# Altium schematic sheet Main.SchDoc
size A3
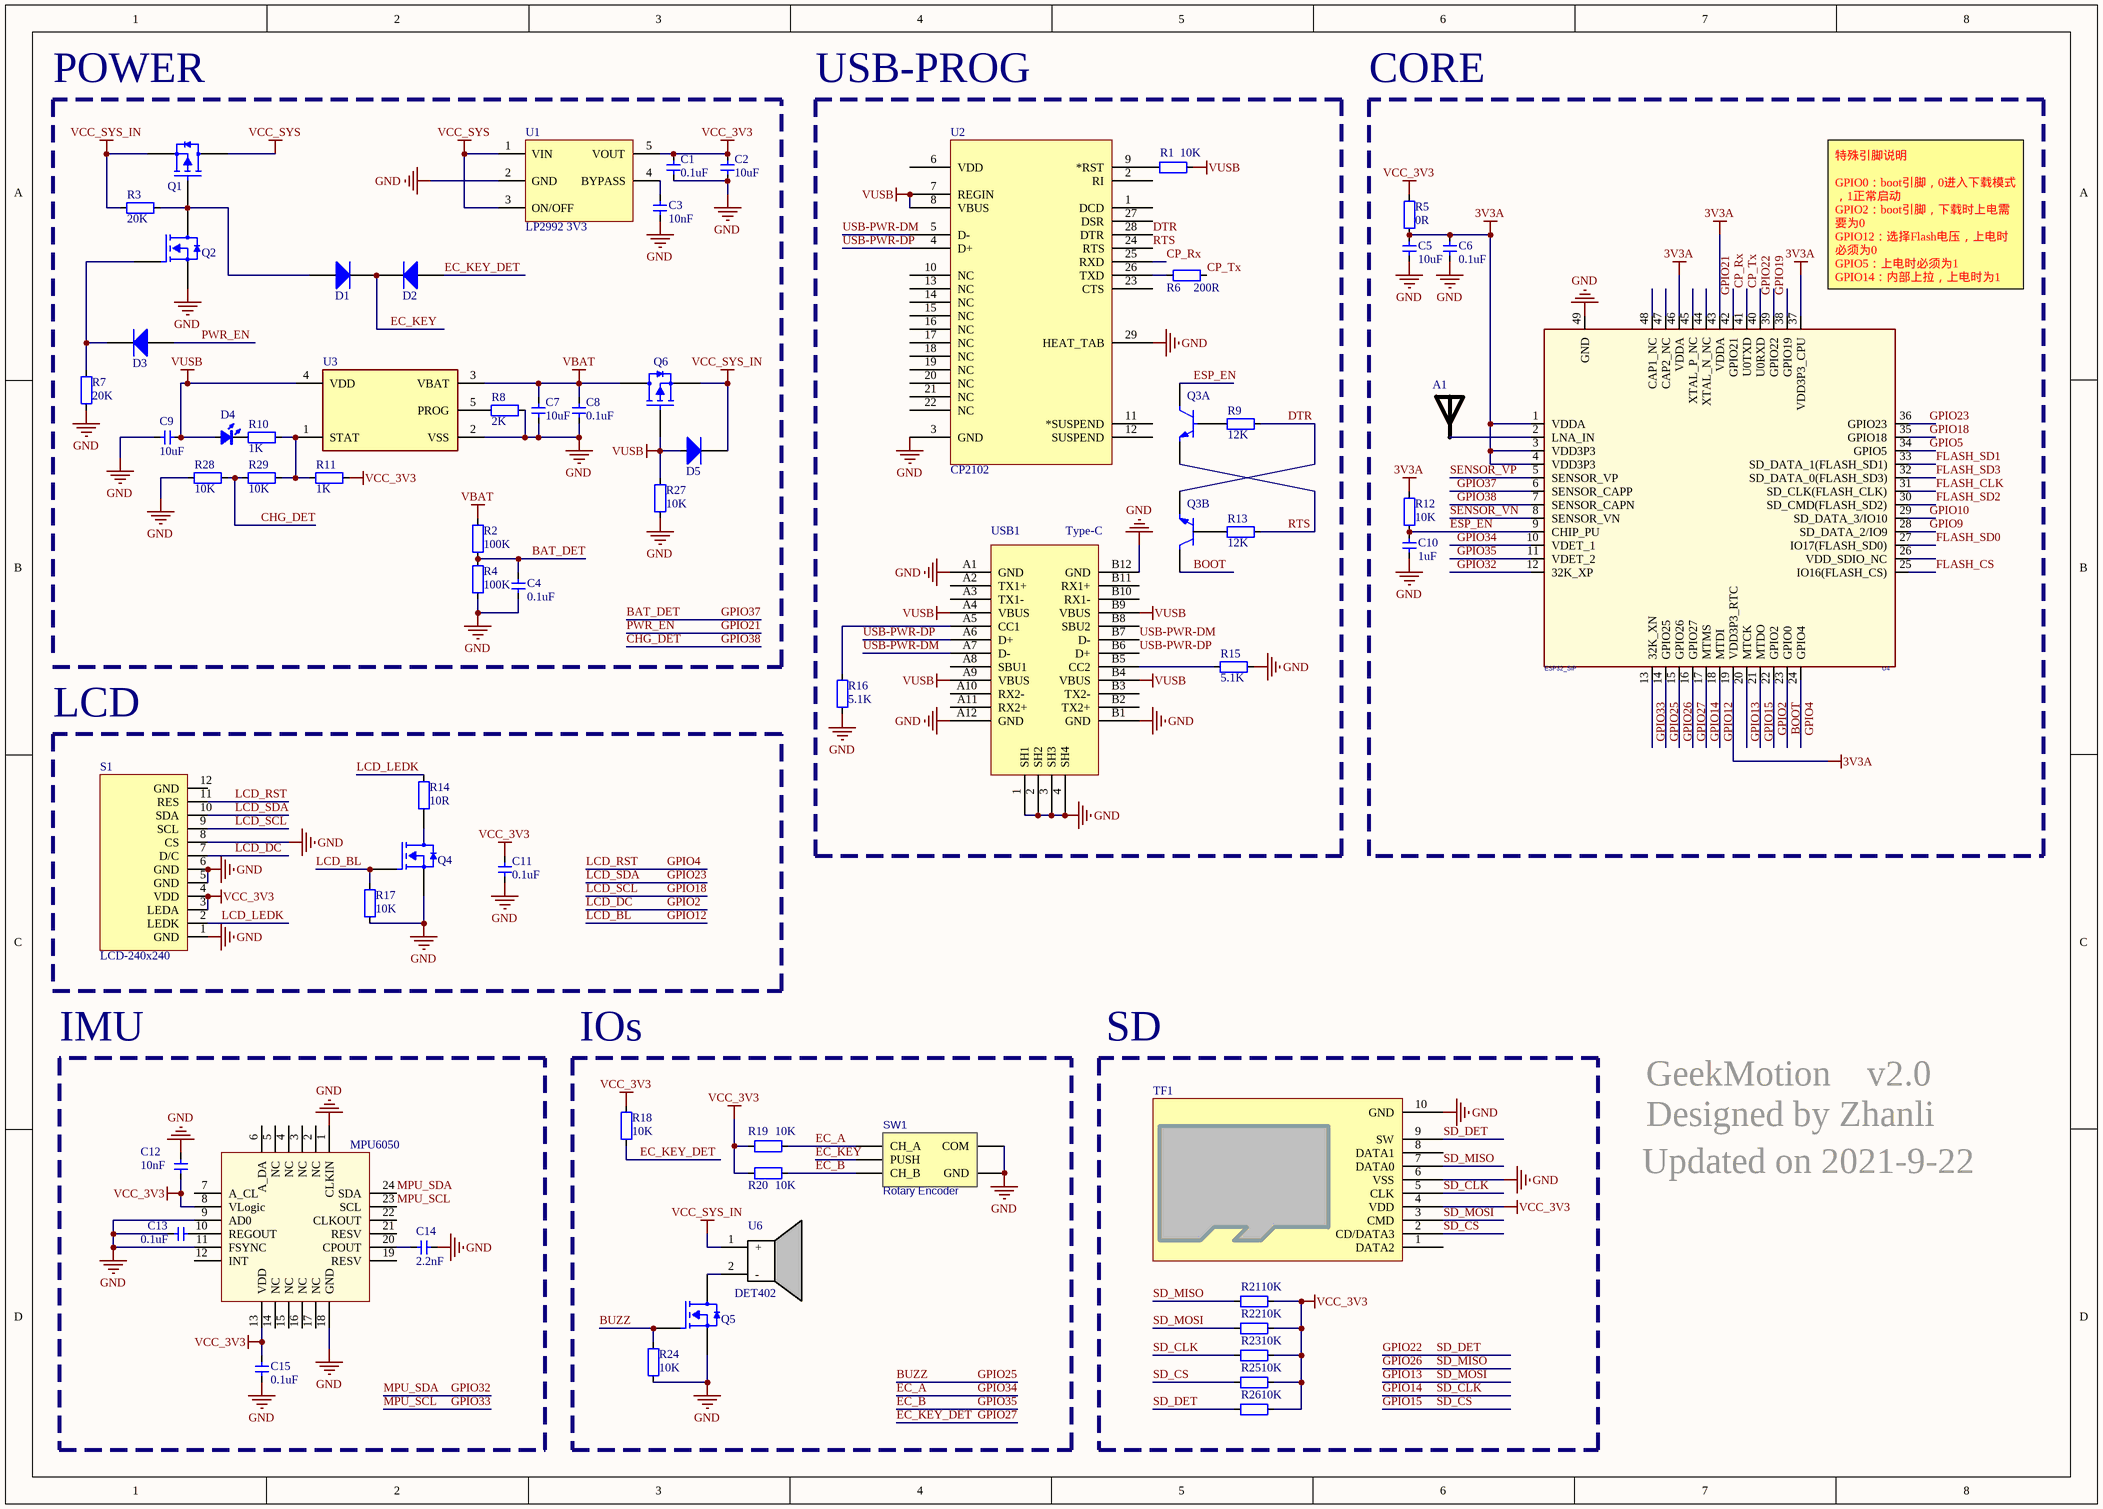
[diagram p0: Main.SchDoc]

## Parts
A1  RAINSUN  [ANT-Rainsun-AN5120]  (value not drawn)
C1  0.1uF  [CAP_0402]
C2  10uF  [CAP_0402]
C3  10nF  [CAP_0402]
C4  0.1uF  [CAP_0402]
C5  10uF  [CAP_0402]
C6  0.1uF  [CAP_0402]
C7  10uF  [CAP_0402]
C8  0.1uF  [CAP_0402]
C9  10uF  [CAP_0402]
C10  1uF  [CAP_0402]
C11  0.1uF  [CAP_0402]
C12  10nF  [CAP_0402]
C13  0.1uF  [CAP_0402]
C14  2.2nF  [CAP_0402]
C15  0.1uF  [CAP_0402]
D1  二极管-5819W  [SOD-323]  (value not drawn)
D2  二极管-5819W  [SOD-323]  (value not drawn)
D3  二极管-5819W  [SOD-323]  (value not drawn)
D4  color?  [LED_0402_RED]  (value not drawn)
D5  二极管-5819W  [SOD-323]  (value not drawn)
Q1  AO3401A  [SOT23-3]  (value not drawn)
Q2  AO3400A  [SOT23-3]  (value not drawn)
Q3  BC847BVC-7  [SOT563-6]  (value not drawn)  (parts A,B of 2)
Q4  AO3400A  [SOT23-3]  (value not drawn)
Q5  AO3400A  [SOT23-3]  (value not drawn)
Q6  AO3401A  [SOT23-3]  (value not drawn)
R1  10K  [RES_0402]
R2  100K  [RES_0402]
R3  20K  [RES_0402]
R4  100K  [RES_0402]
R5  0R  [RES_0402]
R6  200R  [RES_0402]
R7  20K  [RES_0402]
R8  2K  [RES_0402]
R9  12K  [RES_0402]
R10  1K  [RES_0402]
R11  1K  [RES_0402]
R12  10K  [RES_0402]
R13  12K  [RES_0402]
R14  10R  [RES_0402]
R15  5.1K  [RES_0402]
R16  5.1K  [RES_0402]
R17  10K  [RES_0402]
R18  10K  [RES_0402]
R19  10K  [RES_0402]
R20  10K  [RES_0402]
R21  10K  [RES_0402]
R22  10K  [RES_0402]
R23  10K  [RES_0402]
R24  10K  [RES_0402]
R25  10K  [RES_0402]
R26  10K  [RES_0402]
R27  10K  [RES_0402]
R28  10K  [RES_0402]
R29  10K  [RES_0402]
S1  LCD-240x240  [LCD-240x240-FlUSH-154]
SW1  Rotary Encoder  [SIQ-02FVS3]
TF1  TF  [TF-SOCKET]  (value not drawn)
U1  LP2992 3V3  [SOT23-5]
U2  CP2102  [QFN-28]
U3  MCP73831T  [SOT23-5]  (value not drawn)
U4  ESP32_SIP  [QFN-48_7X7]
U5  MPU6050  [QFN-24]
U6  DET402  [DET402]
USB1  Type-C  [Type-C-TOP]

## Blocks framed on the sheet
USB-PROG: Q3 R1 R6 R9 R13 R15 R16 U2 USB1
IMU: C12-C15 U5
IOs: Q5 R18-R20 R24 SW1 U6
SD: R21-R23 R25 R26 TF1

## Nets
3V3A: C5.2 C6.2 R5.2 R12.1 U4.1(VDDA) U4.3(VDD3P3) U4.4(VDD3P3) U4.19(VDD3P3_RTC) U4.37(VDD3P3_CPU) U4.43(VDDA) U4.46(VDDA)
GND: C1.1 C2.1 C3.1 C4.1 C5.1 C6.1 C7.1 C8.1 C9.1 C10.2 C11.1 C12.2 C13.2 C14.1 C15.1 Q2.2(S) Q4.2(S) Q5.2(S) R4.1 R7.1 R8.2 R15.1 R16.2 R17.1 R24.1 R27.1 R28.2 S1.1(GND) S1.5(GND) S1.6(GND) S1.8(CS) SW1.3(COM) SW1.5(GND) TF1.6(VSS) TF1.10(GND) U1.2(GND) U2.3(GND) U2.29(HEAT_TAB) U3.2(VSS) U4.49(GND) U5.1(CLKIN) U5.9(AD0) U5.11(FSYNC) U5.18(GND) USB1.1(SH1) USB1.2(SH2) USB1.3(SH3) USB1.4(SH4) USB1.A1(GND) USB1.A12(GND) USB1.B1(GND) USB1.B12(GND)
VBAT: C7.2 C8.2 Q6.3(D) R2.2 U3.3(VBAT)
VCC_3V3: C1.2 C2.2 C11.2 C12.1 C15.2 R5.1 R11.2 R18.1 R19.2 R20.2 R21.1 R22.1 R23.1 R25.1 R26.1 S1.3(LEDA) S1.4(VDD) TF1.4(VDD) U1.5(VOUT) U5.8(VLogic) U5.13(VDD)
VCC_SYS: Q1.3(D) U1.1(VIN) U1.3(ON/OFF)
VCC_SYS_IN: D5.2(K) Q1.2(S) Q6.2(S) R3.1 U6.1(+)
VUSB: C9.2 D4.1(A) D5.1(A) Q6.1(G) R1.1 R27.2 U2.7(REGIN) U2.8(VBUS) U3.4(VDD) USB1.A4(VBUS) USB1.A9(VBUS) USB1.B4(VBUS) USB1.B9(VBUS)
BAT_DET: C4.2 R2.1 R4.2 U4.6(SENSOR_CAPP)  [also labelled GPIO37]
BOOT: Q3.3(C2) U4.23(GPIO0)
BUZZ: Q5.1(G) R24.2 U4.14(GPIO25)  [also labelled GPIO25]
CHG_DET: R28.1 R29.2 U4.7(SENSOR_CAPN)  [also labelled GPIO38]
CP_Rx: U2.25(RXD) U4.41(U0TXD)
CP_Tx: R6.1 U4.40(U0RXD)
DTR: Q3.4(E2) R9.1 U2.28(DTR)
EC_A: R19.1 SW1.1(CH_A) U4.10(VDET_1)  [also labelled GPIO34]
EC_B: R20.1 SW1.4(CH_B) U4.11(VDET_2)  [also labelled GPIO35]
EC_KEY: D1.2(K) D2.2(K) SW1.2(PUSH)
EC_KEY_DET: D2.1(A) R18.2 U4.16(GPIO27)  [also labelled GPIO27]
ESP_EN: C10.1 Q3.6(C1) R12.2 U4.9(CHIP_PU)
FLASH_CLK: U4.31(SD_CLK(FLASH_CLK))
FLASH_CS: U4.25(IO16(FLASH_CS))
FLASH_SD0: U4.27(IO17(FLASH_SD0))
FLASH_SD1: U4.33(SD_DATA_1(FLASH_SD1))
FLASH_SD2: U4.30(SD_CMD(FLASH_SD2))
FLASH_SD3: U4.32(SD_DATA_0(FLASH_SD3))
GPIO2: S1.7(D/C) U4.22(GPIO2)  [also labelled LCD_DC]
GPIO4: S1.11(RES) U4.24(GPIO4)  [also labelled LCD_RST]
GPIO5: U4.34(GPIO5)
GPIO9: U4.28(SD_DATA_2/IO9)
GPIO10: U4.29(SD_DATA_3/IO10)
GPIO12: Q4.1(G) R17.2 U4.18(MTDI)  [also labelled LCD_BL]
GPIO13: R22.2 TF1.3(CMD) U4.20(MTCK)  [also labelled SD_MOSI]
GPIO14: R23.2 TF1.5(CLK) U4.17(MTMS)  [also labelled SD_CLK]
GPIO15: R25.2 TF1.2(CD/DATA3) U4.21(MTDO)  [also labelled SD_CS]
GPIO18: S1.9(SCL) U4.35(GPIO18)  [also labelled LCD_SCL]
GPIO19: U4.38(GPIO19)
GPIO21: D3.1(A) U4.42(GPIO21)  [also labelled PWR_EN]
GPIO22: R26.2 TF1.9(SW) U4.39(GPIO22)  [also labelled SD_DET]
GPIO23: S1.10(SDA) U4.36(GPIO23)  [also labelled LCD_SDA]
GPIO26: R21.2 TF1.7(DATA0) U4.15(GPIO26)  [also labelled SD_MISO]
GPIO32: U4.12(32K_XP) U5.24(SDA)  [also labelled MPU_SDA]
GPIO33: U4.13(32K_XN) U5.23(SCL)  [also labelled MPU_SCL]
LCD_LEDK: R14.2 S1.2(LEDK)
RTS: Q3.1(E1) R13.1 U2.24(RTS)
SENSOR_VN: U4.8(SENSOR_VN)
SENSOR_VP: U4.5(SENSOR_VP)
USB-PWR-DM: U2.5(D-) USB1.A7(D-) USB1.B7(D-)
USB-PWR-DP: U2.4(D+) USB1.A6(D+) USB1.B6(D+)
NetA1_1: A1.1 U4.2(LNA_IN)
NetC3_2: C3.2 U1.4(BYPASS)
NetC13_1: C13.1 U5.10(REGOUT)
NetC14_2: C14.2 U5.20(CPOUT)
NetD1_1: D1.1(A) Q1.1(G) Q2.3(D) R3.2
NetD3_2: D3.2(K) Q2.1(G) R7.2
NetD4_2: D4.2(K) R10.1
NetQ3_2: Q3.2(B1) R9.2
NetQ3_5: Q3.5(B2) R13.2
NetQ4_3: Q4.3(D) R14.1
NetQ5_3: Q5.3(D) U6.2(-)
NetR1_2: R1.2 U2.9(*RST)
NetR6_2: R6.2 U2.26(TXD)
NetR8_1: R8.1 U3.5(PROG)
NetR10_2: R10.2 R11.1 R29.1 U3.1(STAT)
NetR15_2: R15.2 USB1.B5(CC2)
NetR16_1: R16.1 USB1.A5(CC1)

Not connected (* = marked no-connect by the designer): S1 12(GND); TF1 1(DATA2) 8(DATA1); U2 1(DCD) 2(RI) 6(VDD) 10(NC) 11(*SUSPEND) 12(SUSPEND) 13(NC) 14(NC) 15(NC) 16(NC) 17(NC) 18(NC) 19(NC) 20(NC) 21(NC) 22(NC) 23(CTS) 27(DSR); U4 26(VDD_SDIO_NC) 44(XTAL_N_NC) 45(XTAL_P_NC) 47(CAP2_NC) 48(CAP1_NC); U5 2(NC) 3(NC) 4(NC) 5(NC) 6(A_DA) 7(A_CL) 12(INT) 14(NC) 15(NC) 16(NC) 17(NC) 19(RESV) 21(RESV) 22(CLKOUT); USB1 A2(TX1+) A3(TX1-) A8(SBU1) A10(RX2-) A11(RX2+) B2(TX2+) B3(TX2-) B8(SBU2) B10(RX1-) B11(RX1+)

## Notes on the sheet
- POWER
- CORE
- (near U4) 特殊引脚说明
  GPIO0：boot引脚，0进入下载模式，1正常启动
  GPIO2：boot引脚，下载时上电需要为0
  GPIO12：选择Flash电压，上电时必须为0
  GPIO5：上电时必须为1
  GPIO14：内部上拉，上电时为1
  GPIO15：上电时必须为1
- LCD
- GeekMotion    v2.0
  Designed by Zhanli
- Updated on 2021-9-22

## Library data of the parts
A1 = ANT-Rainsun-AP5120
C1-C15 = 电容-0402: Capacitor; Value: 0.1u
D1-D3 D5 = 二极管-5819W: 40V
D4 = LED_0402: LED; Type: 0402; Value: color?
Q1 Q6 = AO3401A: P-MOS
Q2 Q4 Q5 = AO3400A: N-MOS
R1-R29 = 电阻-0402: Resistor; Value: 22R
S1 = LCD-240x240: 显示屏
SW1 = Rotary Encoder: BOM_Manufacturer: ALPSALPINE; BOM_Manufacturer Part: EC11E1534443; Contributor: LCSC; BOM_Supplier: LCSC; BOM_Supplier Part: C1322543; BOM_JLCPCB Part Class: Extended Part; spicePre: S; spiceSymbolName: EC11E1534443
TF1 = TF卡座: 8脚自弹
U1 = LP2992: LDO
U2 = CP2102: USB转TTL; PART DESC: SINGLE-CHIP USB TO UART BRIDGE, QFN28, RoHS.; MFG #1: SILICON LABS; PART NUMBER: CP2102; Value: Value; RefDes: RefDes; Type: DEV
U4 = ESP32-PICO
U5 = MPU6050: 六轴传感器
USB1 = USB-Type-C-TOP